# Altium schematic sheet arabaKonsolSematik.SchDoc
size D; SheetNumber: 1; SheetTotal: 1
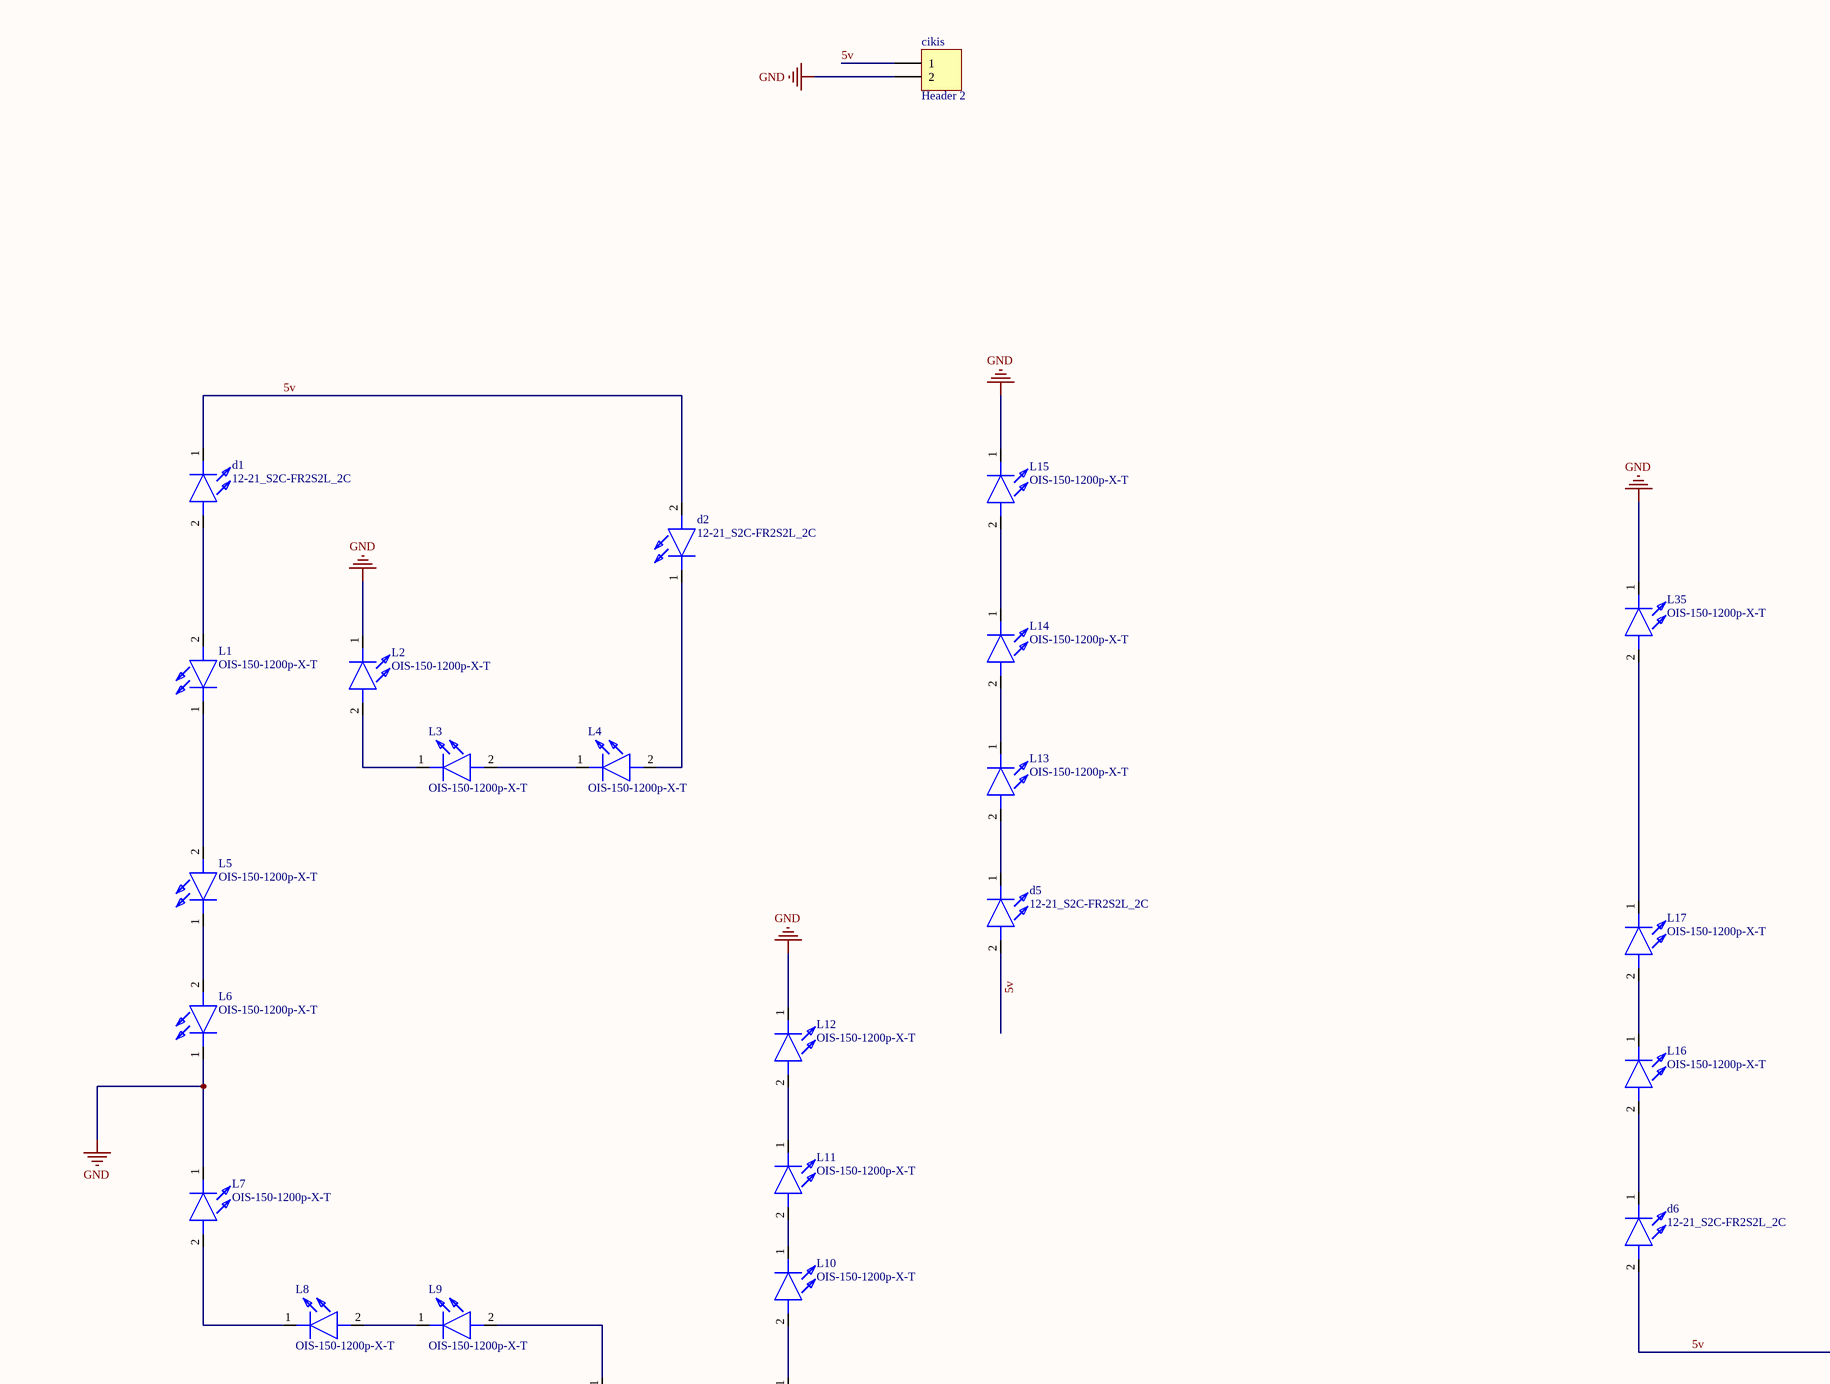
[diagram p0: arabaKonsolSematik.SchDoc, top left]
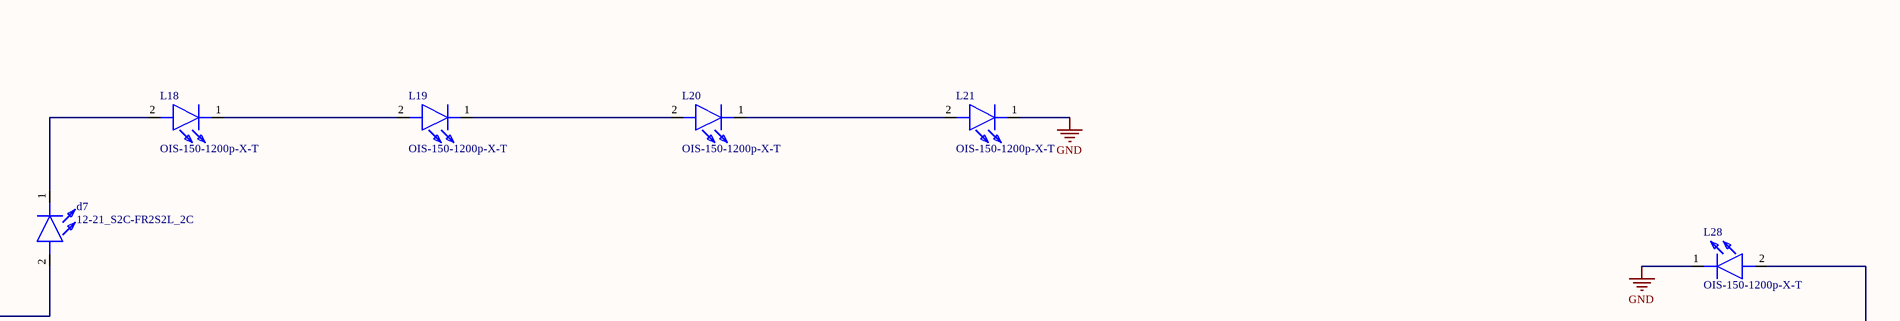
[diagram p1: arabaKonsolSematik.SchDoc, top right]
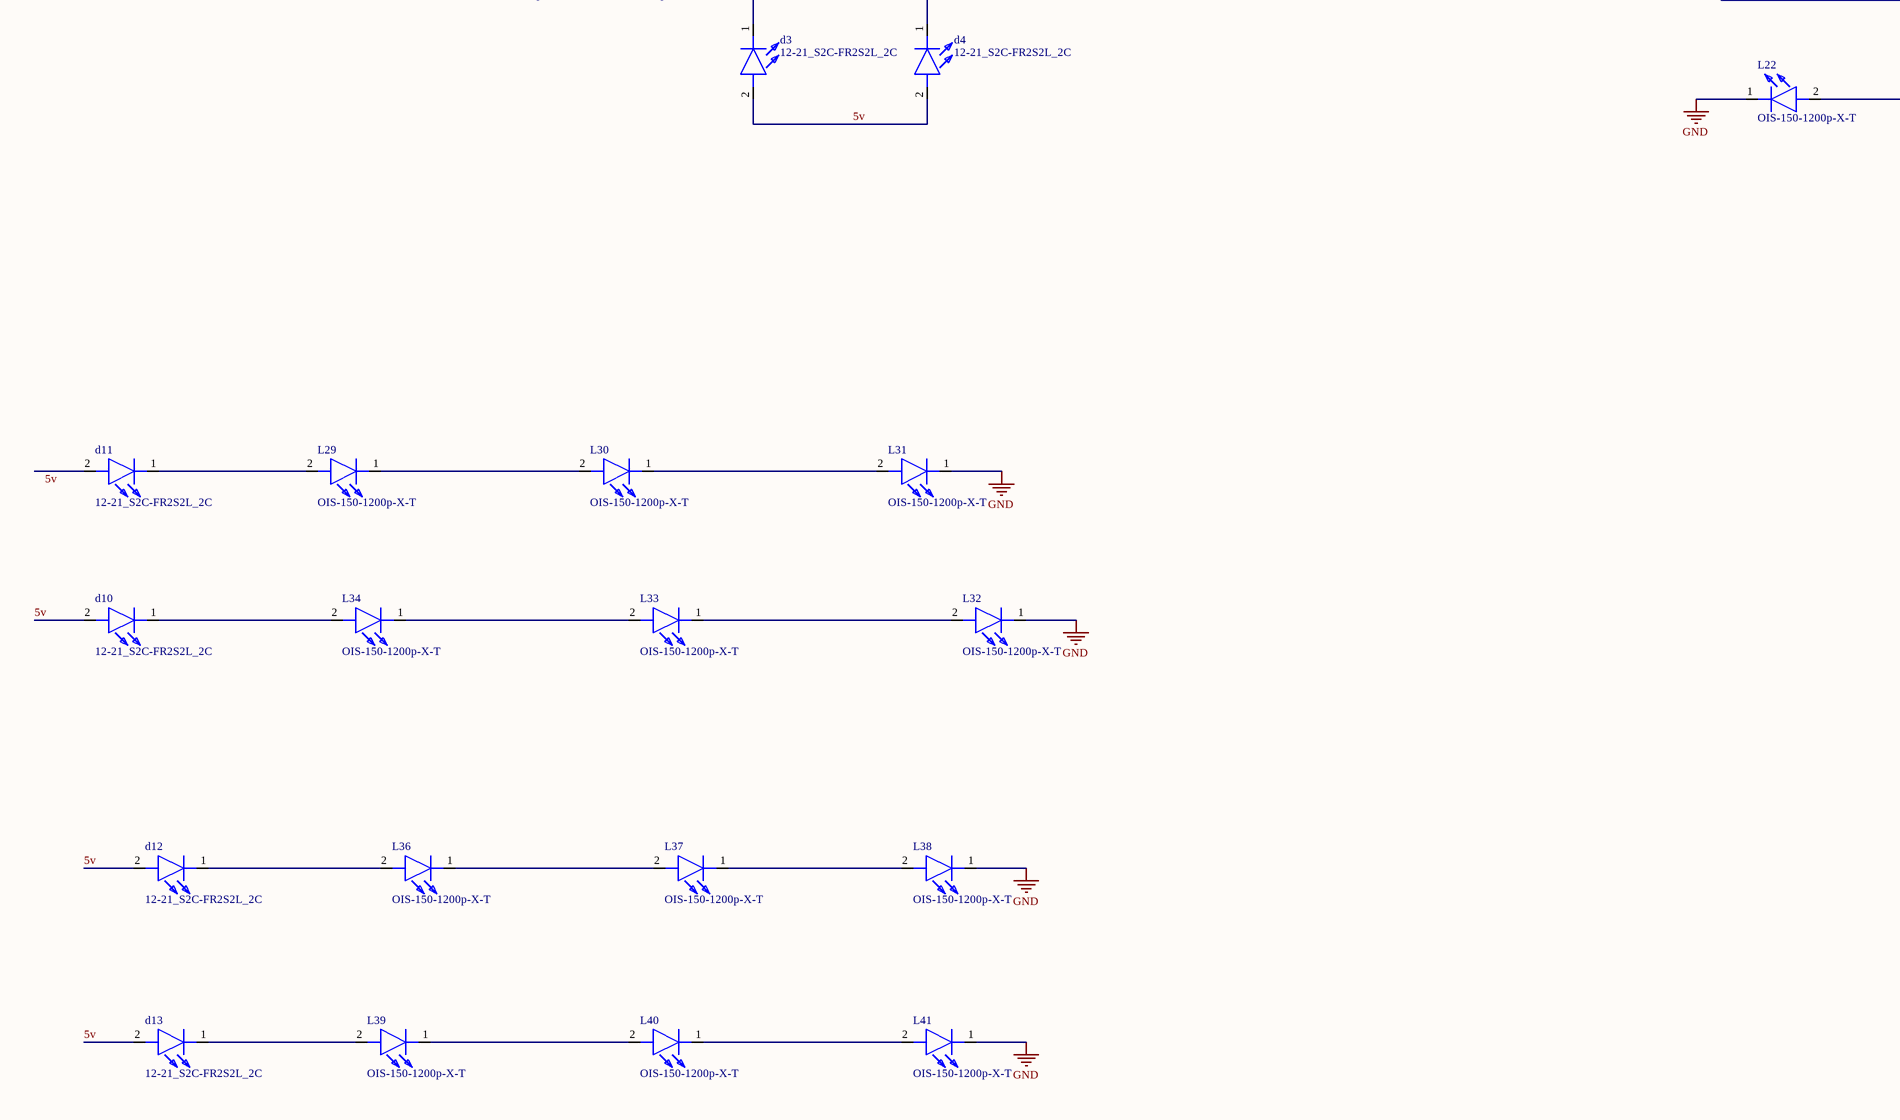
[diagram p2: arabaKonsolSematik.SchDoc, bottom left]
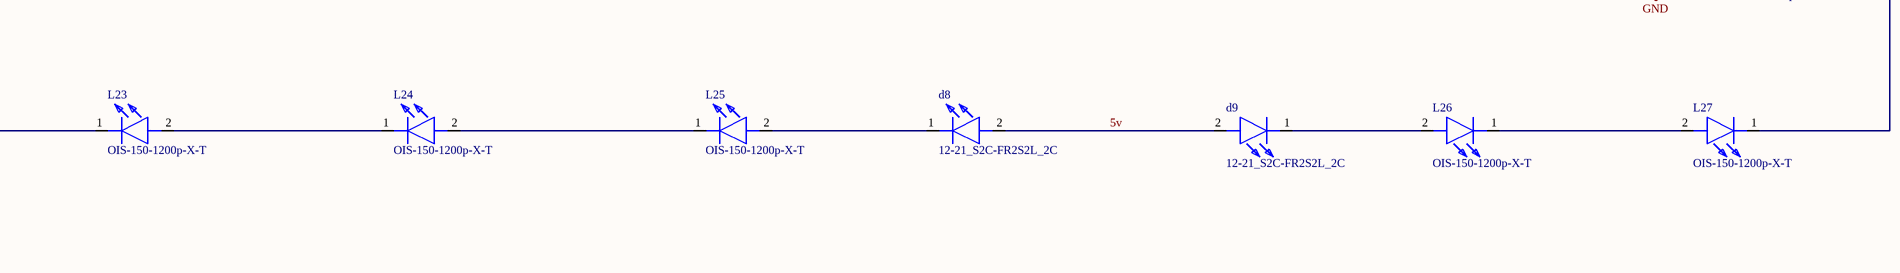
[diagram p3: arabaKonsolSematik.SchDoc, bottom right]

## Parts
cikis  Header 2  [HDR1X2]
d1  12-21_S2C-FR2S2L_2C  [1221S2CFR2S2L2C]
d2  12-21_S2C-FR2S2L_2C  [1221S2CFR2S2L2C]
d3  12-21_S2C-FR2S2L_2C  [1221S2CFR2S2L2C]
d4  12-21_S2C-FR2S2L_2C  [1221S2CFR2S2L2C]
d5  12-21_S2C-FR2S2L_2C  [1221S2CFR2S2L2C]
d6  12-21_S2C-FR2S2L_2C  [1221S2CFR2S2L2C]
d7  12-21_S2C-FR2S2L_2C  [1221S2CFR2S2L2C]
d8  12-21_S2C-FR2S2L_2C  [1221S2CFR2S2L2C]
d9  12-21_S2C-FR2S2L_2C  [1221S2CFR2S2L2C]
d10  12-21_S2C-FR2S2L_2C  [1221S2CFR2S2L2C]
d11  12-21_S2C-FR2S2L_2C  [1221S2CFR2S2L2C]
d12  12-21_S2C-FR2S2L_2C  [1221S2CFR2S2L2C]
d13  12-21_S2C-FR2S2L_2C  [1221S2CFR2S2L2C]
L1  OIS-150-1200p-X-T  [LEDC3216X120N]
L2  OIS-150-1200p-X-T  [LEDC3216X120N]
L3  OIS-150-1200p-X-T  [LEDC3216X120N]
L4  OIS-150-1200p-X-T  [LEDC3216X120N]
L5  OIS-150-1200p-X-T  [LEDC3216X120N]
L6  OIS-150-1200p-X-T  [LEDC3216X120N]
L7  OIS-150-1200p-X-T  [LEDC3216X120N]
L8  OIS-150-1200p-X-T  [LEDC3216X120N]
L9  OIS-150-1200p-X-T  [LEDC3216X120N]
L10  OIS-150-1200p-X-T  [LEDC3216X120N]
L11  OIS-150-1200p-X-T  [LEDC3216X120N]
L12  OIS-150-1200p-X-T  [LEDC3216X120N]
L13  OIS-150-1200p-X-T  [LEDC3216X120N]
L14  OIS-150-1200p-X-T  [LEDC3216X120N]
L15  OIS-150-1200p-X-T  [LEDC3216X120N]
L16  OIS-150-1200p-X-T  [LEDC3216X120N]
L17  OIS-150-1200p-X-T  [LEDC3216X120N]
L18  OIS-150-1200p-X-T  [LEDC3216X120N]
L19  OIS-150-1200p-X-T  [LEDC3216X120N]
L20  OIS-150-1200p-X-T  [LEDC3216X120N]
L21  OIS-150-1200p-X-T  [LEDC3216X120N]
L22  OIS-150-1200p-X-T  [LEDC3216X120N]
L23  OIS-150-1200p-X-T  [LEDC3216X120N]
L24  OIS-150-1200p-X-T  [LEDC3216X120N]
L25  OIS-150-1200p-X-T  [LEDC3216X120N]
L26  OIS-150-1200p-X-T  [LEDC3216X120N]
L27  OIS-150-1200p-X-T  [LEDC3216X120N]
L28  OIS-150-1200p-X-T  [LEDC3216X120N]
L29  OIS-150-1200p-X-T  [LEDC3216X120N]
L30  OIS-150-1200p-X-T  [LEDC3216X120N]
L31  OIS-150-1200p-X-T  [LEDC3216X120N]
L32  OIS-150-1200p-X-T  [LEDC3216X120N]
L33  OIS-150-1200p-X-T  [LEDC3216X120N]
L34  OIS-150-1200p-X-T  [LEDC3216X120N]
L35  OIS-150-1200p-X-T  [LEDC3216X120N]
L36  OIS-150-1200p-X-T  [LEDC3216X120N]
L37  OIS-150-1200p-X-T  [LEDC3216X120N]
L38  OIS-150-1200p-X-T  [LEDC3216X120N]
L39  OIS-150-1200p-X-T  [LEDC3216X120N]
L40  OIS-150-1200p-X-T  [LEDC3216X120N]
L41  OIS-150-1200p-X-T  [LEDC3216X120N]

## Nets
GND: cikis.2 L2.1(K) L6.1(K) L7.1(K) L12.1(K) L15.1(K) L21.1(K) L22.1(K) L28.1(K) L31.1(K) L32.1(K) L35.1(K) L38.1(K) L41.1(K)
5v: cikis.1 d1.1(K) d2.2(A) d3.2(A) d4.2(A) d5.2(A) d6.2(A) d7.2(A) d8.2(A) d9.2(A) d10.2(A) d11.2(A) d12.2(A) d13.2(A)
Netd1_2: d1.2(A) L1.2(A)
Netd2_1: d2.1(K) L4.2(A)
Netd3_1: d3.1(K) L9.2(A)
Netd4_1: d4.1(K) L10.2(A)
Netd5_1: d5.1(K) L13.2(A)
Netd6_1: d6.1(K) L16.2(A)
Netd7_1: d7.1(K) L18.2(A)
Netd8_1: d8.1(K) L25.2(A)
Netd9_1: d9.1(K) L26.2(A)
Netd10_1: d10.1(K) L34.2(A)
Netd11_1: d11.1(K) L29.2(A)
Netd12_1: d12.1(K) L36.2(A)
Netd13_1: d13.1(K) L39.2(A)
NetL1_1: L1.1(K) L5.2(A)
NetL2_2: L2.2(A) L3.1(K)
NetL3_2: L3.2(A) L4.1(K)
NetL5_1: L5.1(K) L6.2(A)
NetL7_2: L7.2(A) L8.1(K)
NetL8_2: L8.2(A) L9.1(K)
NetL10_1: L10.1(K) L11.2(A)
NetL11_1: L11.1(K) L12.2(A)
NetL13_1: L13.1(K) L14.2(A)
NetL14_1: L14.1(K) L15.2(A)
NetL16_1: L16.1(K) L17.2(A)
NetL17_1: L17.1(K) L35.2(A)
NetL18_1: L18.1(K) L19.2(A)
NetL19_1: L19.1(K) L20.2(A)
NetL20_1: L20.1(K) L21.2(A)
NetL22_2: L22.2(A) L23.1(K)
NetL23_2: L23.2(A) L24.1(K)
NetL24_2: L24.2(A) L25.1(K)
NetL26_1: L26.1(K) L27.2(A)
NetL27_1: L27.1(K) L28.2(A)
NetL29_1: L29.1(K) L30.2(A)
NetL30_1: L30.1(K) L31.2(A)
NetL32_2: L32.2(A) L33.1(K)
NetL33_2: L33.2(A) L34.1(K)
NetL36_1: L36.1(K) L37.2(A)
NetL37_1: L37.1(K) L38.2(A)
NetL39_1: L39.1(K) L40.2(A)
NetL40_1: L40.1(K) L41.2(A)

## Library data of the parts
cikis = Header 2: Header, 2-Pin; LatestRevisionDate: 17-Jul-2002; LatestRevisionNote: Re-released for DXP Platform.; Publisher: Altium Limited
d1-d13 = 12-21_S2C-FR2S2L_2C: LED; Manufacturer_Name: EVERLIGHT ELECTRONICS; Manufacturer_Part_Number: 12-21/S2C-FR2S2L/2C; Datasheet Link: https://datasheet.lcsc.com/szlcsc/1901141904_Everlight-Elec-12-21-S2C-FR2S2L-2C_C183856.pdf; Height: 2.2mm
L1-L41 = OIS-150-1200p-X-T: LED; Manufacturer_Name: OSA Opto; Datasheet Link: http://uk.rs-online.com/web/p/products/1736249; Height: 1.2mm; Manufacturer_Part_Number: OIS-150-1200p-X-T